# EAGLE schematic wireless_attachment (EAGLE 7.6.0)
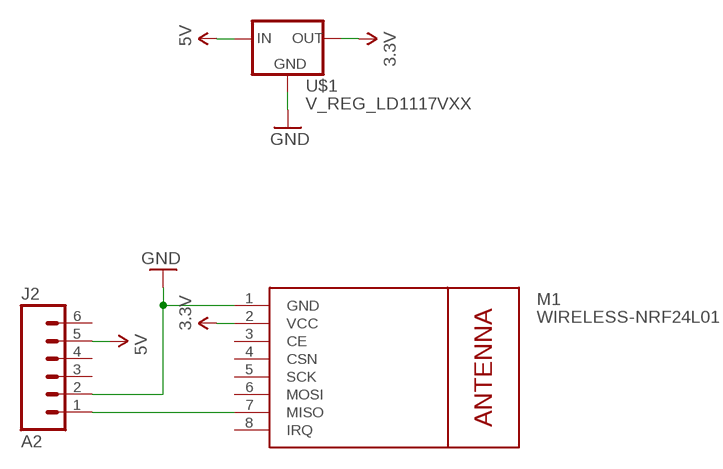
[diagram p0: schematic, sheet 1]

## Parts
J2  A2  M06VERNIER-ANALOG  [BTA]
M1  WIRELESS-NRF24L01  [WIRELESS-NRF24L01]
U$1  V_REG_LD1117VXX  [78XXL]

## Nets
3.3V: M1.2(VCC) U$1.GND(OUT)
5V: J2.5 U$1.OUT(IN)
GND: J2.2 M1.1(GND) U$1.IN(GND)
S1-5V1: J2.1 M1.7(MISO)
Unconnected: J2.3 J2.4 J2.6 M1.3(CE) M1.4(CSN) M1.5(SCK) M1.6(MOSI) M1.8(IRQ)

## Library data of the parts
J2 = SparkFun-Connectors:M06: Header 6 Standard 6-pin 0.1" header. Use with straight break away headers (SKU : PRT-00116), right angle break away headers (PRT-00553), swiss pins (PRT-00743), machine pins (PRT-00117), and female headers (PRT-00115). Molex polarized connector foot print use with SKU : PRT-08094 with associated crimp pins and housings. NOTES ON THE VARIANTS LOCK and LOCK_LONGPADS... This footprint was designed to help hold the alignment of a through-hole component (i.e. 6-pin header) while soldering it into place. You may notice that each hole has been shifted either up or down by 0.005 of an inch from it's more standard position (which is a perfectly straight line). This slight alteration caused the pins (the squares in the middle) to touch the edges of the holes. Because they are alternating, it causes a "brace" to hold the component in place. 0.005 has proven to be the perfect amount of "off-center" position when using our standard breakaway headers. Although looks a little odd when you look at the bare footprint, once you have a header in there, the alteration is very hard to notice. Also,if you push a header all the way into place, it is covered up entirely on the bottom side. This idea of altering the position of holes to aid alignment will be further integrated into the Sparkfun Library for other footprints. It can help hold any component with 3 or more connection pins.
M1 = diy-modules:WIRELESS-NRF24L01: 2.4 GHz Wireless Module based on NRF24L01 chip More details available here: http://www.electrodragon.com/w/NRF24L01 Click here to find device on ebay.com <http://www.ebay.com/sch/nrf24l01+arduino>
U$1 = SparkFun-PowerIC:V_REG_LD1117VXX: LD1117VXX voltage regulator. We carry the 3.3V version (COM-00526) in TO-220 package.